# Altium schematic sheet сеточная модуляция. параллельное питание.SchDoc
size A4; SheetNumber: 1; SheetTotal: 1
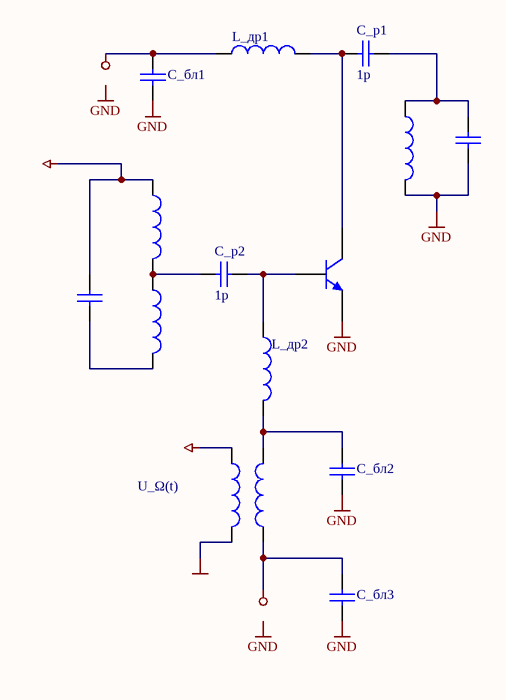
[diagram p0: сеточная модуляция. параллельное питание.SchDoc]

## Parts
(Parts that share a designator on the sheet are numbered #1, #2 ... from top to bottom, then left to right.)
?#1  Inductor  (value not drawn)
?#2  Capacitor  (value not drawn)
?#3  Inductor  (value not drawn)
?#4  Capacitor  (value not drawn)
?#5  Inductor  (value not drawn)
?#6  Bipolar NPN 3 Pins Transistor Modified Version of the Gummel-Poon Model  (value not drawn)
C_p1  value 1p  (hidden comment: Capacitor)
C_бл1  Capacitor  (value not drawn)
C_бл2  Capacitor  (value not drawn)
C_бл3  Capacitor  (value not drawn)
C_р2  value 1p  (hidden comment: Capacitor)
L_др1  Inductor  (value not drawn)
L_др2  Inductor  (value not drawn)
U_Ω(t)  Pair of Coupled Inductors  (value not drawn)

## Nets
GND: ?#1.2 ?#2.2 ?#6.3(E) C_бл1.1 C_бл2.2 C_бл3.2
Net?#3_1: ?#3.1 ?#4.1 C_бл1.2 C_бл3.1 L_др1.1 U_Ω(t).1 U_Ω(t).2 U_Ω(t).3
Net?#1_1: ?#1.1 ?#2.1 C_p1.1
Net?#3_2: ?#3.2 ?#5.1 C_р2.1
Net?#4_2: ?#4.2 ?#5.2
Net?#6_1: ?#6.1(C) C_p1.2 L_др1.2
Net?#6_2: ?#6.2(B) C_р2.2 L_др2.1
NetC_бл2_1: C_бл2.1 L_др2.2 U_Ω(t).4

## Notes on the sheet
- Labels drawn without touching a wire or pin: GND

## Library data of the parts
?#1 ?#3 ?#5 L_др1 L_др2 = Inductor: SimulationGenericComponent: True
?#2 ?#4 C_p1 C_бл1-C_бл3 C_р2 = Capacitor: SimulationGenericComponent: True
?#6 = BJT NPN_MGP: BF: 100; AF: 0; BR: 1; EG: 1.11; FC: 0.5; IS: 1e-16; MJC: 0.33; NC: 2; NE: 1.5; TNOM: 27; VBC_MAX: 1e99; VJC: 0.75; XTI: 3; SimulationGenericComponent: True; CJC: 0; CJE: 0; CJS: 0; CTC: 0; CTE: 0; CTS: 0; IKF: 0; IKR: 0; IRB: 0; ISC: 0; ISE: 0; ISS: 0; ITF: 0; KF: 0; MJE: 0.33; MJS: 0; NF: 1; NKF: 0.5; NR: 1; NS: 1; PTF: 0; RB: 0; RBM: 0; RC: 0; RE: 0; SUBS: 1; TBF1: 0; TBF2: 0; TBR1: 0; TBR2: 0; TF: 0; TIKF1: 0; TIKF2: 0; TIKR1: 0; TIKR2: 0; TIRB1: 0; TIRB2: 0; TIS1: 0; TIS2: 0; TISC1: 0; TISC2: 0; TISE1: 0; TISE2: 0; TITF1: 0; TITF2: 0; TLEV: 0; TLEVC: 0; TMJC1: 0; TMJC2: 0; TMJE1: 0; TMJE2: 0; TMJS1: 0; TMJS2: 0; TNC1: 0; TNC2: 0; TNE1: 0; TNE2: 0; TNF1: 0; TNF2: 0; TNR1: 0; TNR2: 0; TNS1: 0; TNS2: 0; TR: 0; TRB1: 0; TRB2: 0; TRC1: 0; TRC2: 0; TRE1: 0; TRE2: 0; TRM1: 0; TRM2: 0; TTF1: 0; TTF2: 0; TTR1: 0; TTR2: 0; TVAF1: 0; TVAF2: 0; TVAR1: 0; TVAR2: 0; TVJC: 0; TVJE: 0; TVJS: 0; VAF: 0; VAR: 0; VBE_MAX: 1e99; VCE_MAX: 1e99; VJE: 0.75; VJS: 0.75; VTF: 0; XCJC: 1; XTB: 0; XTF: 0
U_Ω(t) = Coupled Inductors: SimulationGenericComponent: True